# Altium project OCP-TimeCardMini-TI.PrjPcb (part 2 of 6)

## Sheet 07-1G Phy1.SchDoc
size B; SheetNumber: 7; SheetTotal: 25; SPICEModelCacheWFXGVWAF: <root> / <DocumentId>WFXGVWAF</DocumentId> / <CacheFrame Number="0"> / <Model Name="emk105bj105_v-f" Kind="CKT"> / <Text>* EMK105BJ105_V-F     SPICE MODEL  ( General Type ) / *-------------------------------------------------------------------------------------------------------- / * Model Generated by TAIYO YUDEN Corporation (http://www.ty-top.com) / * Version 1.0 / * TAIYO YUDEN Control No. 170508_130520 / * Copyright(c) 2012 TAIYO YUDEN CO.,LTD. All Rights Reserved. / *-------------------------------------------------------------------------------------------------------- / * / * Products Name : Multilayer Ceramic Capacitors / * / * Characteristics : / *     Capacitance : 1 uF , Rated Voltage : 16V , TCC : X5R / *     Case Size : 1.0 x 0.5 / 0.039 x 0.02 [mm/inch] , Thickness : 0.5 / 0.02 [mm/inch] / *     (Conditions: Temperature = 25 degC , DC Bias Current/Voltage = 0A / 0V) / * / * Frequency Range : 40Hz - 3GHz / * / * External Node Assignments : / * / *  1  o---| |---o  2 / * / *-------------------------------------------------------------------------------------------------------- / .SubCkt EMK105BJ105_V-F 1 2 / **************************** / C0 1 110 0.68309u / Cm 1 101 0.26053u / C1 101 102 0.94076u / Rc1 101 102 1.9029k / C2 102 103 0.66707u / Rc2 102 103 120.36 / C3 103 110 0.57203u / Rc3 103 110 2.1097 / C2m 1 301 0.1871u / C21 301 302 3.2494u / Rc21 301 302 1.1117k / C22 302 303 2.1014u / Rc22 302 303 1.484k / C23 303 304 2.1172u / Rc23 303 304 1.3876k / C24 304 305 0.75729u / Rc24 304 305 332.59 / C25 305 306 0.94401u / Rc25 305 306 249.09 / C26 306 307 0.34674u / Rc26 306 307 28.352 / C27 307 308 0.37158u / Rc27 307 308 19.989 / C28 308 309 0.17933u / Rc28 308 309 31.748 / C29 309 110 0.016445u / Rc29 309 110 1.0592 / Rp0 1 110 100Meg / L0 110 120 0.2216n / Lm 120 130 0.1509n / L1 120 121 0.12659n / RL1 121 130 0.85161 / L2 120 122 0.15996n / RL2 122 130 0.42469 / L3 120 123 7.9543n / RL3 123 130 0.54643m / CR 120 124 0.24334u / LR 124 125 0.090738n / RR 125 130 68.076m / CL 130 140 2.7354p / LL 130 140 0.10762n / RL 130 140 50.614 / Rs 140 2 7.5416m / **************************** / .ends EMK105BJ105_V-F</Text> / </Model> / </CacheFrame> / </root>
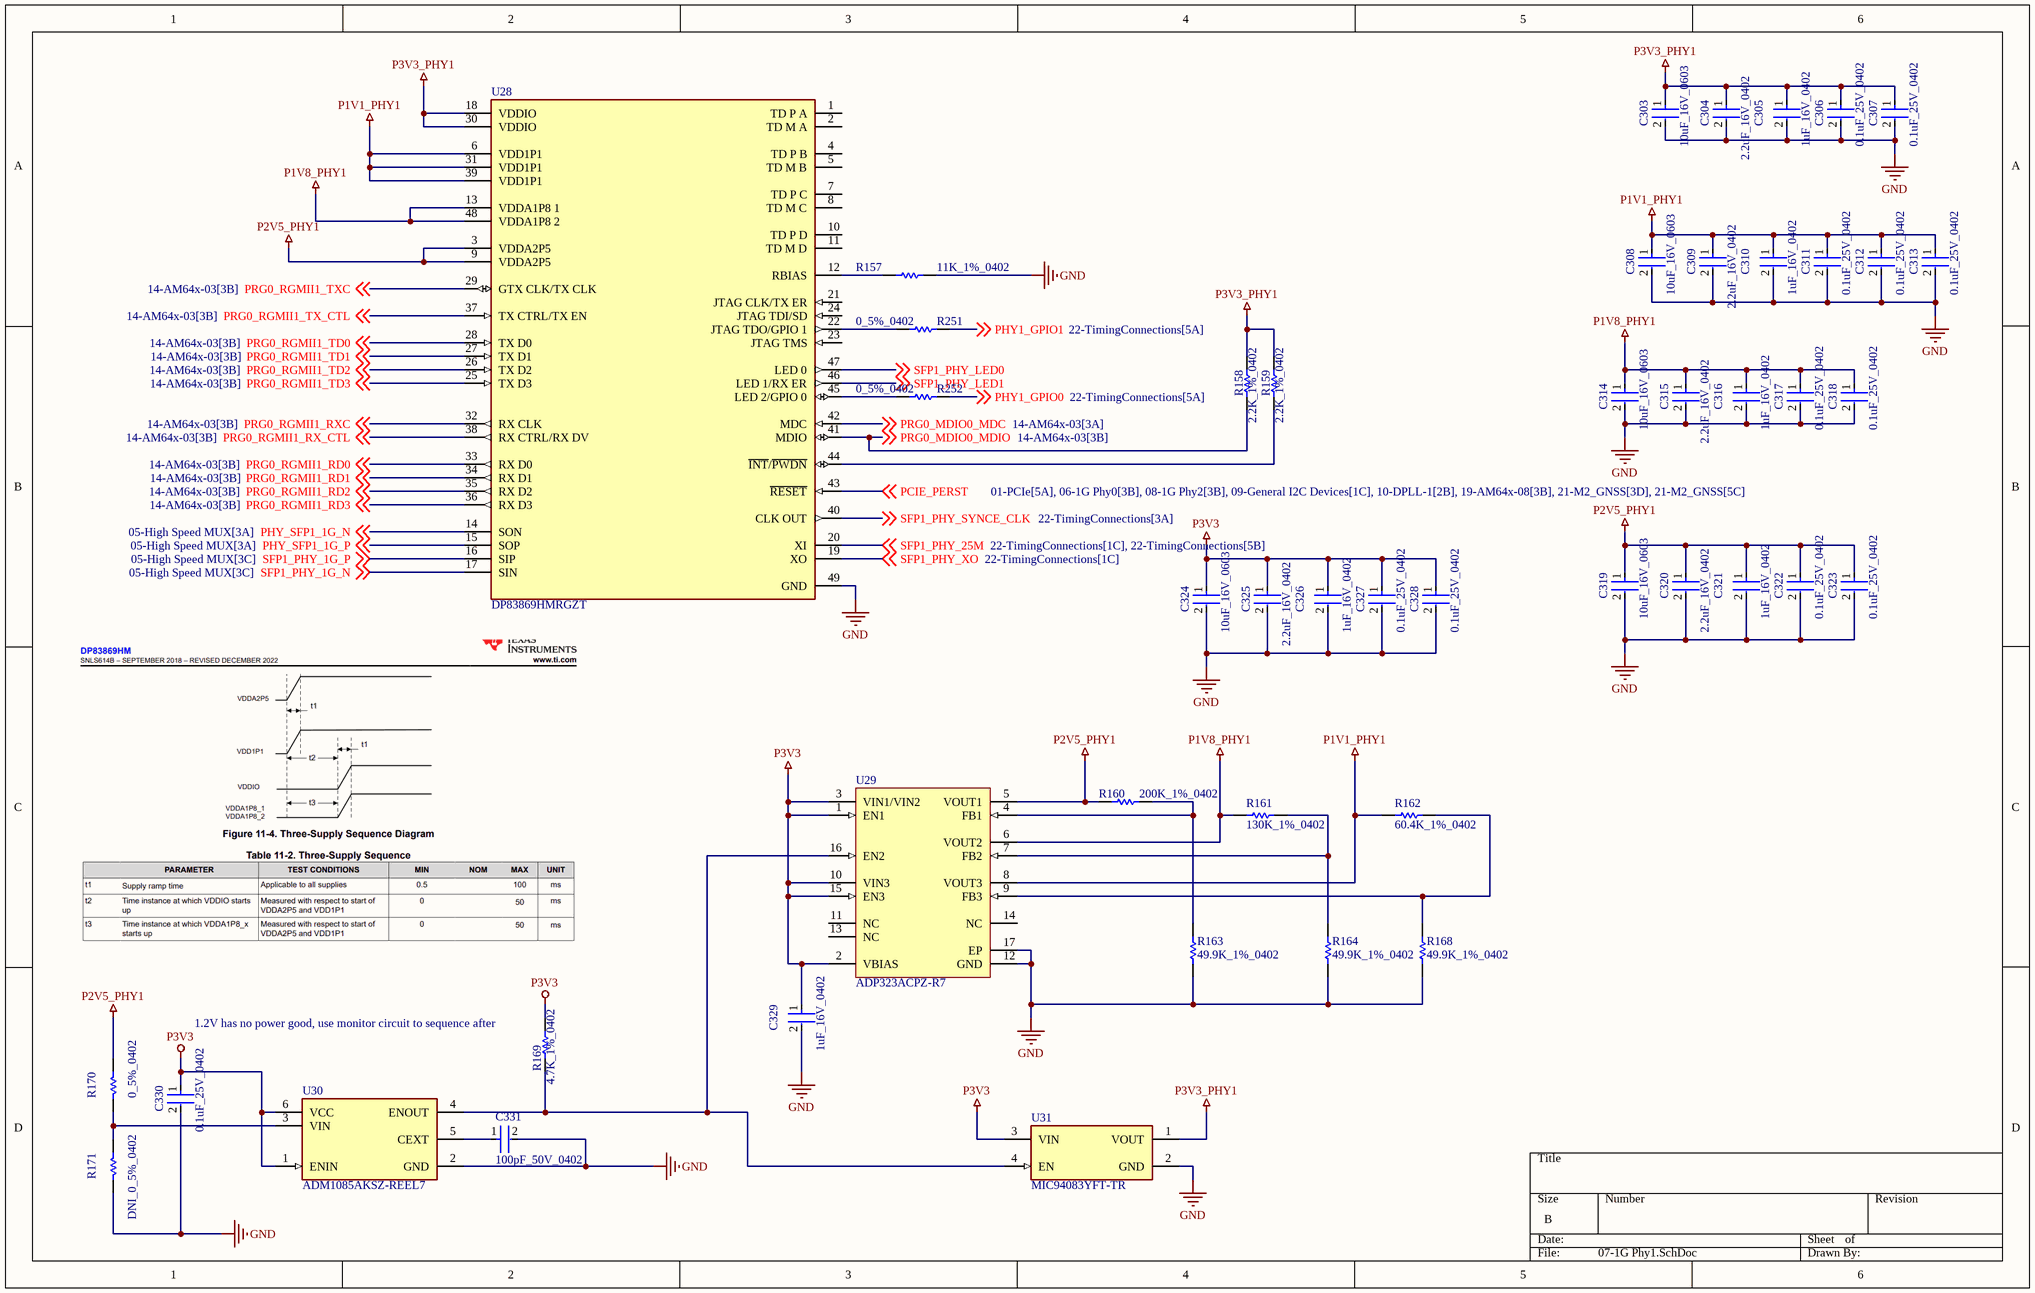
[diagram p6: 07-1G Phy1.SchDoc]

### Parts
C303  10uF_16V_0603  [FP-0603-L_1_6_0_2-W_0_8_0-MFG]
C304  2.2uF_16V_0402  [FP-C1005-050-0_05-IPC_A]
C305  1uF_16V_0402  [FP-0402-L_1_0_0_05-W_0_5-IPC_A]
C306  0.1uF_25V_0402  [FP-0402-L_1_0_1-W_0_5_0_1-IPC_C]
C307  0.1uF_25V_0402  [FP-0402-L_1_0_1-W_0_5_0_1-IPC_C]
C308  10uF_16V_0603  [FP-0603-L_1_6_0_2-W_0_8_0-MFG]
C309  2.2uF_16V_0402  [FP-C1005-050-0_05-IPC_A]
C310  1uF_16V_0402  [FP-0402-L_1_0_0_05-W_0_5-IPC_A]
C311  0.1uF_25V_0402  [FP-0402-L_1_0_1-W_0_5_0_1-IPC_C]
C312  0.1uF_25V_0402  [FP-0402-L_1_0_1-W_0_5_0_1-IPC_C]
C313  0.1uF_25V_0402  [FP-0402-L_1_0_1-W_0_5_0_1-IPC_C]
C314  10uF_16V_0603  [FP-0603-L_1_6_0_2-W_0_8_0-MFG]
C315  2.2uF_16V_0402  [FP-C1005-050-0_05-IPC_A]
C316  1uF_16V_0402  [FP-0402-L_1_0_0_05-W_0_5-IPC_A]
C317  0.1uF_25V_0402  [FP-0402-L_1_0_1-W_0_5_0_1-IPC_C]
C318  0.1uF_25V_0402  [FP-0402-L_1_0_1-W_0_5_0_1-IPC_C]
C319  10uF_16V_0603  [FP-0603-L_1_6_0_2-W_0_8_0-MFG]
C320  2.2uF_16V_0402  [FP-C1005-050-0_05-IPC_A]
C321  1uF_16V_0402  [FP-0402-L_1_0_0_05-W_0_5-IPC_A]
C322  0.1uF_25V_0402  [FP-0402-L_1_0_1-W_0_5_0_1-IPC_C]
C323  0.1uF_25V_0402  [FP-0402-L_1_0_1-W_0_5_0_1-IPC_C]
C324  10uF_16V_0603  [FP-0603-L_1_6_0_2-W_0_8_0-MFG]
C325  2.2uF_16V_0402  [FP-C1005-050-0_05-IPC_A]
C326  1uF_16V_0402  [FP-0402-L_1_0_0_05-W_0_5-IPC_A]
C327  0.1uF_25V_0402  [FP-0402-L_1_0_1-W_0_5_0_1-IPC_C]
C328  0.1uF_25V_0402  [FP-0402-L_1_0_1-W_0_5_0_1-IPC_C]
C329  1uF_16V_0402  [FP-0402-L_1_0_0_05-W_0_5-IPC_A]
C330  0.1uF_25V_0402  [FP-0402-L_1_0_1-W_0_5_0_1-IPC_C]
C331  100pF_50V_0402  [FP-C0402-BB-MFG]
R157  11K_1%_0402  [RESC1005X40X25LL05T10]
R158  2.2K_1%_0402  [RESC1005X40X25ML10T10]
R159  2.2K_1%_0402  [RESC1005X40X25ML10T10]
R160  200K_1%_0402  [RESC1005X40X25LL10T10]
R161  130K_1%_0402  [RESC1005X40X25NL10T10]
R162  60.4K_1%_0402  [RESC1005X40X25LL05T10]
R163  49.9K_1%_0402  [RESC1005X40X25LL10T10]
R164  49.9K_1%_0402  [RESC1005X40X25LL10T10]
R168  49.9K_1%_0402  [RESC1005X40X25LL10T10]
R169  4.7K_1%_0402  [RESC1005X40X25NL10T10]
R170  0_5%_0402  [RESC1005X40X25LL10T10]
R171  DNI_0_5%_0402  [RESC1005X40X25LL10T10]  (no BOM)
R251  0_5%_0402  [RESC1005X40X25LL10T10]
R252  0_5%_0402  [RESC1005X40X25LL10T10]
U28  DP83869HMRGZT  [FP-RGZ0048B-IPC_A]
U29  ADP323ACPZ-R7  [ADI-CP-16-27_N]
U30  ADM1085AKSZ-REEL7  [FP-KS-6-IPC_B]
U31  MIC94083YFT-TR  [FP-FTDFN085085-4LD-PL-1-MFG]

### Nets
GND: C303.2 C304.2 C305.2 C306.2 C307.2 C308.2 C309.2 C310.2 C311.2 C312.2 C313.2 C314.2 C315.2 C316.2 C317.2 C318.2 C319.2 C320.2 C321.2 C322.2 C323.2 C324.2 C325.2 C326.2 C327.2 C328.2 C329.2 C330.2 C331.2 R157.2 R163.1 R164.1 R168.1 R171.2 U28.49(GND) U29.12(GND) U29.17(EP) U30.2(GND) U31.2(GND)
P1V1_PHY1: C308.1 C309.1 C310.1 C311.1 C312.1 C313.1 R162.1 U28.6(VDD1P1) U28.31(VDD1P1) U28.39(VDD1P1) U29.8(VOUT3)
P1V8_PHY1: C314.1 C315.1 C316.1 C317.1 C318.1 R161.1 U28.13(VDDA1P8_1) U28.48(VDDA1P8_2) U29.6(VOUT2)
P2V5_PHY1: C319.1 C320.1 C321.1 C322.1 C323.1 R160.1 R170.1 U28.3(VDDA2P5) U28.9(VDDA2P5) U29.5(VOUT1)
P3V3: C324.1 C325.1 C326.1 C327.1 C328.1 C329.1 C330.1 R169.1 U29.1(EN1) U29.2(VBIAS) U29.3(VIN1/VIN2) U29.10(VIN3) U29.15(EN3) U30.1(ENIN) U30.6(VCC) U31.3(VIN)
P3V3_PHY1: C303.1 C304.1 C305.1 C306.1 C307.1 R158.2 R159.2 U28.18(VDDIO) U28.30(VDDIO) U31.1(VOUT)
PCIE_PERST: U28.43(~{RESET}) ; off-sheet PCIE_PERST
PHY1_GPIO0: R252.2 ; off-sheet PHY1_GPIO0
PHY1_GPIO1: R251.2 ; off-sheet PHY1_GPIO1
PHY_SFP1_1G_N: U28.14(SON) ; off-sheet PHY_SFP1_1G_N
PHY_SFP1_1G_P: U28.15(SOP) ; off-sheet PHY_SFP1_1G_P
PRG0_MDIO0_MDC: U28.42(MDC) ; off-sheet PRG0_MDIO0_MDC
PRG0_MDIO0_MDIO: R158.1 U28.41(MDIO) ; off-sheet PRG0_MDIO0_MDIO
PRG0_RGMII1_RD0: U28.33(RX_D0) ; off-sheet PRG0_RGMII1_RD0
PRG0_RGMII1_RD1: U28.34(RX_D1) ; off-sheet PRG0_RGMII1_RD1
PRG0_RGMII1_RD2: U28.35(RX_D2) ; off-sheet PRG0_RGMII1_RD2
PRG0_RGMII1_RD3: U28.36(RX_D3) ; off-sheet PRG0_RGMII1_RD3
PRG0_RGMII1_RX_CTL: U28.38(RX_CTRL/RX_DV) ; off-sheet PRG0_RGMII1_RX_CTL
PRG0_RGMII1_RXC: U28.32(RX_CLK) ; off-sheet PRG0_RGMII1_RXC
PRG0_RGMII1_TD0: U28.28(TX_D0) ; off-sheet PRG0_RGMII1_TD0
PRG0_RGMII1_TD1: U28.27(TX_D1) ; off-sheet PRG0_RGMII1_TD1
PRG0_RGMII1_TD2: U28.26(TX_D2) ; off-sheet PRG0_RGMII1_TD2
PRG0_RGMII1_TD3: U28.25(TX_D3) ; off-sheet PRG0_RGMII1_TD3
PRG0_RGMII1_TX_CTL: U28.37(TX_CTRL/TX_EN) ; off-sheet PRG0_RGMII1_TX_CTL
PRG0_RGMII1_TXC: U28.29(GTX_CLK/TX_CLK) ; off-sheet PRG0_RGMII1_TXC
SFP1_PHY_1G_N: U28.17(SIN) ; off-sheet SFP1_PHY_1G_N
SFP1_PHY_1G_P: U28.16(SIP) ; off-sheet SFP1_PHY_1G_P
SFP1_PHY_25M: U28.20(XI) ; off-sheet SFP1_PHY_25M
SFP1_PHY_LED0: U28.47(LED_0) ; off-sheet SFP1_PHY_LED0
SFP1_PHY_LED1: U28.46(LED_1/RX_ER) ; off-sheet SFP1_PHY_LED1
SFP1_PHY_SYNCE_CLK: U28.40(CLK_OUT) ; off-sheet SFP1_PHY_SYNCE_CLK
SFP1_PHY_XO: U28.19(XO) ; off-sheet SFP1_PHY_XO
NetC331_1: C331.1 U30.5(CEXT)
NetR157_1: R157.1 U28.12(RBIAS)
NetR159_1: R159.1 U28.44(~{INT}/~{PWDN})
NetR160_2: R160.2 R163.2 U29.4(FB1)
NetR161_2: R161.2 R164.2 U29.7(FB2)
NetR162_2: R162.2 R168.2 U29.9(FB3)
NetR169_2: R169.2 U29.16(EN2) U30.4(ENOUT) U31.4(EN)
NetR170_2: R170.2 R171.1 U30.3(VIN)
NetR251_1: R251.1 U28.22(JTAG_TDO/GPIO_1)
NetR252_1: R252.1 U28.45(LED_2/GPIO_0)

Not connected (* = marked no-connect by the designer): U28 1(TD_P_A) 2(TD_M_A) 4(TD_P_B) 5(TD_M_B) 7(TD_P_C) 8(TD_M_C) 10(TD_P_D) 11(TD_M_D) 21(JTAG_CLK/TX_ER) 23(JTAG_TMS) 24(JTAG_TDI/SD); U29 11(NC) 13(NC) 14(NC)

### Notes on the sheet
- (near R169) 1.2V has no power good, use monitor circuit to sequence after

### Library data of the parts
C303 C308 C314 C319 C324 = CMP-2000-06226-4: Multilayer Ceramic Capacitor 10uF 16V X5R 20% SMD 0603 T/R; Packaging: Tape and Reel; Construction: Flat; Height: 0.8mm; Max Operating Temperature: 85°C; Dielectric: X5R; Case Code (Metric): 1608; Voltage Rating (DC): 16V; Width: 0.031inch; Voltage Rating: 16V; Length: 0.063inch; RoHS Compliant: Yes; Halogen Free: Halogen Free; Case Code (Imperial): 0603; Capacitance: 10uF; Mount: Surface Mount; Thickness: 0.031inch; Tolerance: 20%; Min Operating Temperature: -55°C; Series: M; Termination: SMD/SMT; Case/Package: 0603; Package Quantity: 1
C304 C309 C315 C320 C325 = CMP-2000-05998-2: Multilayer Ceramic Capacitors 2.2μF ±10% 16V X5R SMD 0402; Capacitance: 2.2uF; REACH SVHC: No SVHC; Series: C; Termination: SMD/SMT; Case Code (Imperial): 0402; Depth: 0.5mm; Mount: Surface Mount; Width: 0.02inch; Package Quantity: 1; Dielectric Material: Ceramic; Length: 1mm; Packaging: Tape and Reel; Case Code (Metric): 1005; RoHS Compliant: Yes; Dielectric: X5R; Max Operating Temperature: 85°C; Lead Free: Lead Free; Weight: 2.3E-05oz; Thickness: 0.022inch; Voltage Rating (DC): 16V; Tolerance: 10%; Voltage Rating: 16V; Resistor Type: Ceramic; Height: 0.5mm; Case/Package: 0402; Min Operating Temperature: -55°C
C305 C310 C316 C321 C326 C329 = CMP-14477-000104-2: None; Tolerance: 10%; Voltage Rating: 16V; Dielectric: X5R; Capacitance: 1uF; Packaging: Tape and Reel; Depth: 0.5mm; Mount: Surface Mount; Thickness: 0.022inch; Package Quantity: 1; Min Operating Temperature: -55°C; Series: M; Voltage Rating (DC): 16V; Termination: SMD/SMT; Case/Package: 0402; Number of Pins: 2; Case Code (Imperial): 0402; Length: 1mm; Halogen Free: Halogen Free; Case Code (Metric): 1005; Width: 0.02inch; RoHS Compliant: Yes; Radiation Hardening: No; Max Operating Temperature: 85°C; Height: 0.5mm; Construction: Flat
C306 C307 C311-C313 C317 C318 C322 C323 C327 C328 C330 = CMP-2008-02519-2: as C26 on sheet 02-USER_IO; Package Quantity: 1; Capacitance: 100nF; Min Operating Temperature: -55°C; Voltage: 25V; Voltage Rating: 25V; Construction: Flat; Max Operating Temperature: 125°C; Radiation Hardening: No; Depth: 0.5mm; Thickness: 0.022inch; Voltage Rating (DC): 25V; Number of Pins: 2; Lead Free: Lead Free; Series: -; REACH SVHC: No SVHC; Length: 1mm; Dielectric: X7R; RoHS Compliant: Yes; Mount: Surface Mount; Packaging: Tape and Reel; Case/Package: 0402; Case Code (Imperial): 0402; Termination: SMD/SMT; Width: 0.02inch; Case Code (Metric): 1005; Tolerance: 10%
C331 = CMP-2008-03417-2: CAP CER 100PF 50V C0G/NP0 0402; Manufacturer: Kemet; Manufacturer Part Number: C0402C101G5GACTU; Material: Ceramic; Temperature Characteristic: C0G; Tolerance: 0.02; Temperature Coefficient: 15%; Temperature Range High: +125°C; Lead Free: Yes; Capacitance: 100 pF; Value: 100 pF; ComponentLink2URL: https://content.kemet.com/datasheets/KEM_C1002_X7R_SMD.pdf; Automotive: No; Voltage Rating: 50 V; Category: Cap; Device Class L2: Capacitors; ComponentLink2Description: Datasheet; Mouser Description: Multilayer Ceramic Capacitors MLCC - SMD/SMT 50volts 100pF C0G 2%; RoHS: TRUE; Device Class L3: Ceramic Capacitors; Temperature Range Low: -55°C; Octopart: https://octopart.com/c0402c101g5gactu-kemet-16782744; Height: 0.55mm; Ipc Land Pattern Name: CAPC10050X50; Package: C0402-BB; Device Class L1: Passive Components; Temperature: -55°C to +125°C; Digikey Description: CAP CER 100PF 50V C0G/NP0 0402
R157 = CMP-2002-07365-1: Manufacturer: Yageo / Phycomp; Part Number: RC0402FR-0711KL
R158 R159 = CMP-2002-06097-1: Part Number: MC00625W040212K2; Manufacturer: Multicomp
R160 = CMP-2002-04904-1: Part Number: CR0402-FX-2003GLF; Manufacturer: Bourns
R161 = CMP-2002-05688-1: Part Number: CRG0402F130K; Manufacturer: TE Connectivity / AMP
R162 = CMP-2002-07763-1: Manufacturer: Yageo / Phycomp; Part Number: RC0402FR-0760K4L
R163 R164 R168 = CMP-1011-00702-2: Manufacturer: Bourns; Part Number: CR0402-FX-4992GLF
R169 = CMP-2002-05217-1: as R22 on sheet 01-PCIe
R170 R171 R251 R252 = CMP-2002-04569-1: as R23 on sheet 01-PCIe
U28 = CMP-04874-000002-2: IC TRANSCEIVER 1/1 48FN; RoHS Compliant: Yes
U29 = CMP-0786-00062-1: Triple, 200 mA, Low Noise, High PSRR Voltage Regulator, 2.5 to 5.5 V Vin, Adjustable Vout, Industrial, 16-pin QFN (CP-16-27), Reel; Manufacturer: Analog Devices; Vout Adjustable Range: 0.5V to 5V; Iout max: 200mA; Vin (max) (V): 5.5; Supply Current IGND @ Small Load: 85uA; Vin (min) (V): 2.5; ComponentLink2URL: http://www.analog.com/static/imported-files/data_sheets/ADP322_323.pdf; Code_JEDEC: MO-229; Mounting Technology: Surface Mount; DatasheetVersion: Rev. A; PartNumber: ADP323ACPZ-R7; ComponentLink3URL: http://www.analog.com/static/imported-files/packages/PKG_PDF/LFCSP(CP)/CP_16_27.pdf; ComponentLink4Description: URL Link1; PackageVersion: 091609-A, 09/2009; ComponentLink1Description: Manufacturer URL; ComponentLink3Description: Package Specification; Packing: Reel; PackageReference: CP-16-27; ComponentLink4URL: Product URL:http://www.analog.com/en/ADP323/productSearch.html; ComponentLink1URL: http://www.analog.com/en/index.html; PackageDescription: 16-Pin Lead Frame Chip Scale Package, Body 3 x 3 mm, Pitch 0.5 mm; ComponentLink2Description: Datasheet
U30 = CMP-09140-000008-1: IC SUPERVISOR 1 CHANNEL SC70-6; Min Reset Threshold Voltage: 560mV; Operating Supply Voltage: 125V; Operating Supply Current: 10uA; Reset: Active High; Max Reset Threshold Voltage: 640mV; Watchdog Timer: No; Min Supply Voltage: 2.25V; Number of Voltages Monitored: 1; Max Supply Current: 15uA; Threshold Voltage: 600mV; Max Supply Voltage: 3.6V; Nominal Supply Current: 10uA; Mount: Surface Mount; Width: 1.35mm; Max Operating Temperature: 125°C; Lead Free: Contains Lead; Package Quantity: 3000; Undervoltage Threshold: 560mV; Type: Sequencer; Packaging: Tape and Reel; Min Operating Temperature: -40°C; Radiation Hardening: No; REACH SVHC: No SVHC; Overvoltage Threshold: 640mV; Number of Pins: 6; Case/Package: SC; Length: 2.2mm; Height: 1mm; Number of Monitored Inputs: 1
U31 = CMP-06317-000053-1: IC PWR SWITCH P-CHAN 1:1 4TMLF; Turn-On Delay Time: 1.5us; Turn-Off Delay Time: 200ns; On-State Resistance: 67mR; Output Current: 2A; Min Supply Voltage: 1.7V; Number of Outputs: 1; Interface: On/Off; Output Configuration: High Side; Max Supply Voltage: 5.5V; Radiation Hardening: No; Min Operating Temperature: -40°C; Mount: Surface Mount; Series: -; RoHS Compliant: Yes; Number of Pins: 4; Reach SVHC Compliant: Yes; On-state Resistance-Max: 67MR; Package Quantity: 5000; Packaging: Tape and Reel; Max Output Current: 2A; Supply Current: 2A; Lead Free: Lead Free; Current Rating: 2A; Max Operating Temperature: 125°C; Rated Current-Max: 2A; Nominal Supply Current: 2A

## Sheet 08-1G Phy2.SchDoc
size B; SheetNumber: 8; SheetTotal: 25; SPICEModelCacheUFVORJTV: <root> / <DocumentId>UFVORJTV</DocumentId> / <CacheFrame Number="0"> / <Model Name="emk105bj105_v-f" Kind="CKT"> / <Text>* EMK105BJ105_V-F     SPICE MODEL  ( General Type ) / *-------------------------------------------------------------------------------------------------------- / * Model Generated by TAIYO YUDEN Corporation (http://www.ty-top.com) / * Version 1.0 / * TAIYO YUDEN Control No. 170508_130520 / * Copyright(c) 2012 TAIYO YUDEN CO.,LTD. All Rights Reserved. / *-------------------------------------------------------------------------------------------------------- / * / * Products Name : Multilayer Ceramic Capacitors / * / * Characteristics : / *     Capacitance : 1 uF , Rated Voltage : 16V , TCC : X5R / *     Case Size : 1.0 x 0.5 / 0.039 x 0.02 [mm/inch] , Thickness : 0.5 / 0.02 [mm/inch] / *     (Conditions: Temperature = 25 degC , DC Bias Current/Voltage = 0A / 0V) / * / * Frequency Range : 40Hz - 3GHz / * / * External Node Assignments : / * / *  1  o---| |---o  2 / * / *-------------------------------------------------------------------------------------------------------- / .SubCkt EMK105BJ105_V-F 1 2 / **************************** / C0 1 110 0.68309u / Cm 1 101 0.26053u / C1 101 102 0.94076u / Rc1 101 102 1.9029k / C2 102 103 0.66707u / Rc2 102 103 120.36 / C3 103 110 0.57203u / Rc3 103 110 2.1097 / C2m 1 301 0.1871u / C21 301 302 3.2494u / Rc21 301 302 1.1117k / C22 302 303 2.1014u / Rc22 302 303 1.484k / C23 303 304 2.1172u / Rc23 303 304 1.3876k / C24 304 305 0.75729u / Rc24 304 305 332.59 / C25 305 306 0.94401u / Rc25 305 306 249.09 / C26 306 307 0.34674u / Rc26 306 307 28.352 / C27 307 308 0.37158u / Rc27 307 308 19.989 / C28 308 309 0.17933u / Rc28 308 309 31.748 / C29 309 110 0.016445u / Rc29 309 110 1.0592 / Rp0 1 110 100Meg / L0 110 120 0.2216n / Lm 120 130 0.1509n / L1 120 121 0.12659n / RL1 121 130 0.85161 / L2 120 122 0.15996n / RL2 122 130 0.42469 / L3 120 123 7.9543n / RL3 123 130 0.54643m / CR 120 124 0.24334u / LR 124 125 0.090738n / RR 125 130 68.076m / CL 130 140 2.7354p / LL 130 140 0.10762n / RL 130 140 50.614 / Rs 140 2 7.5416m / **************************** / .ends EMK105BJ105_V-F</Text> / </Model> / </CacheFrame> / </root>
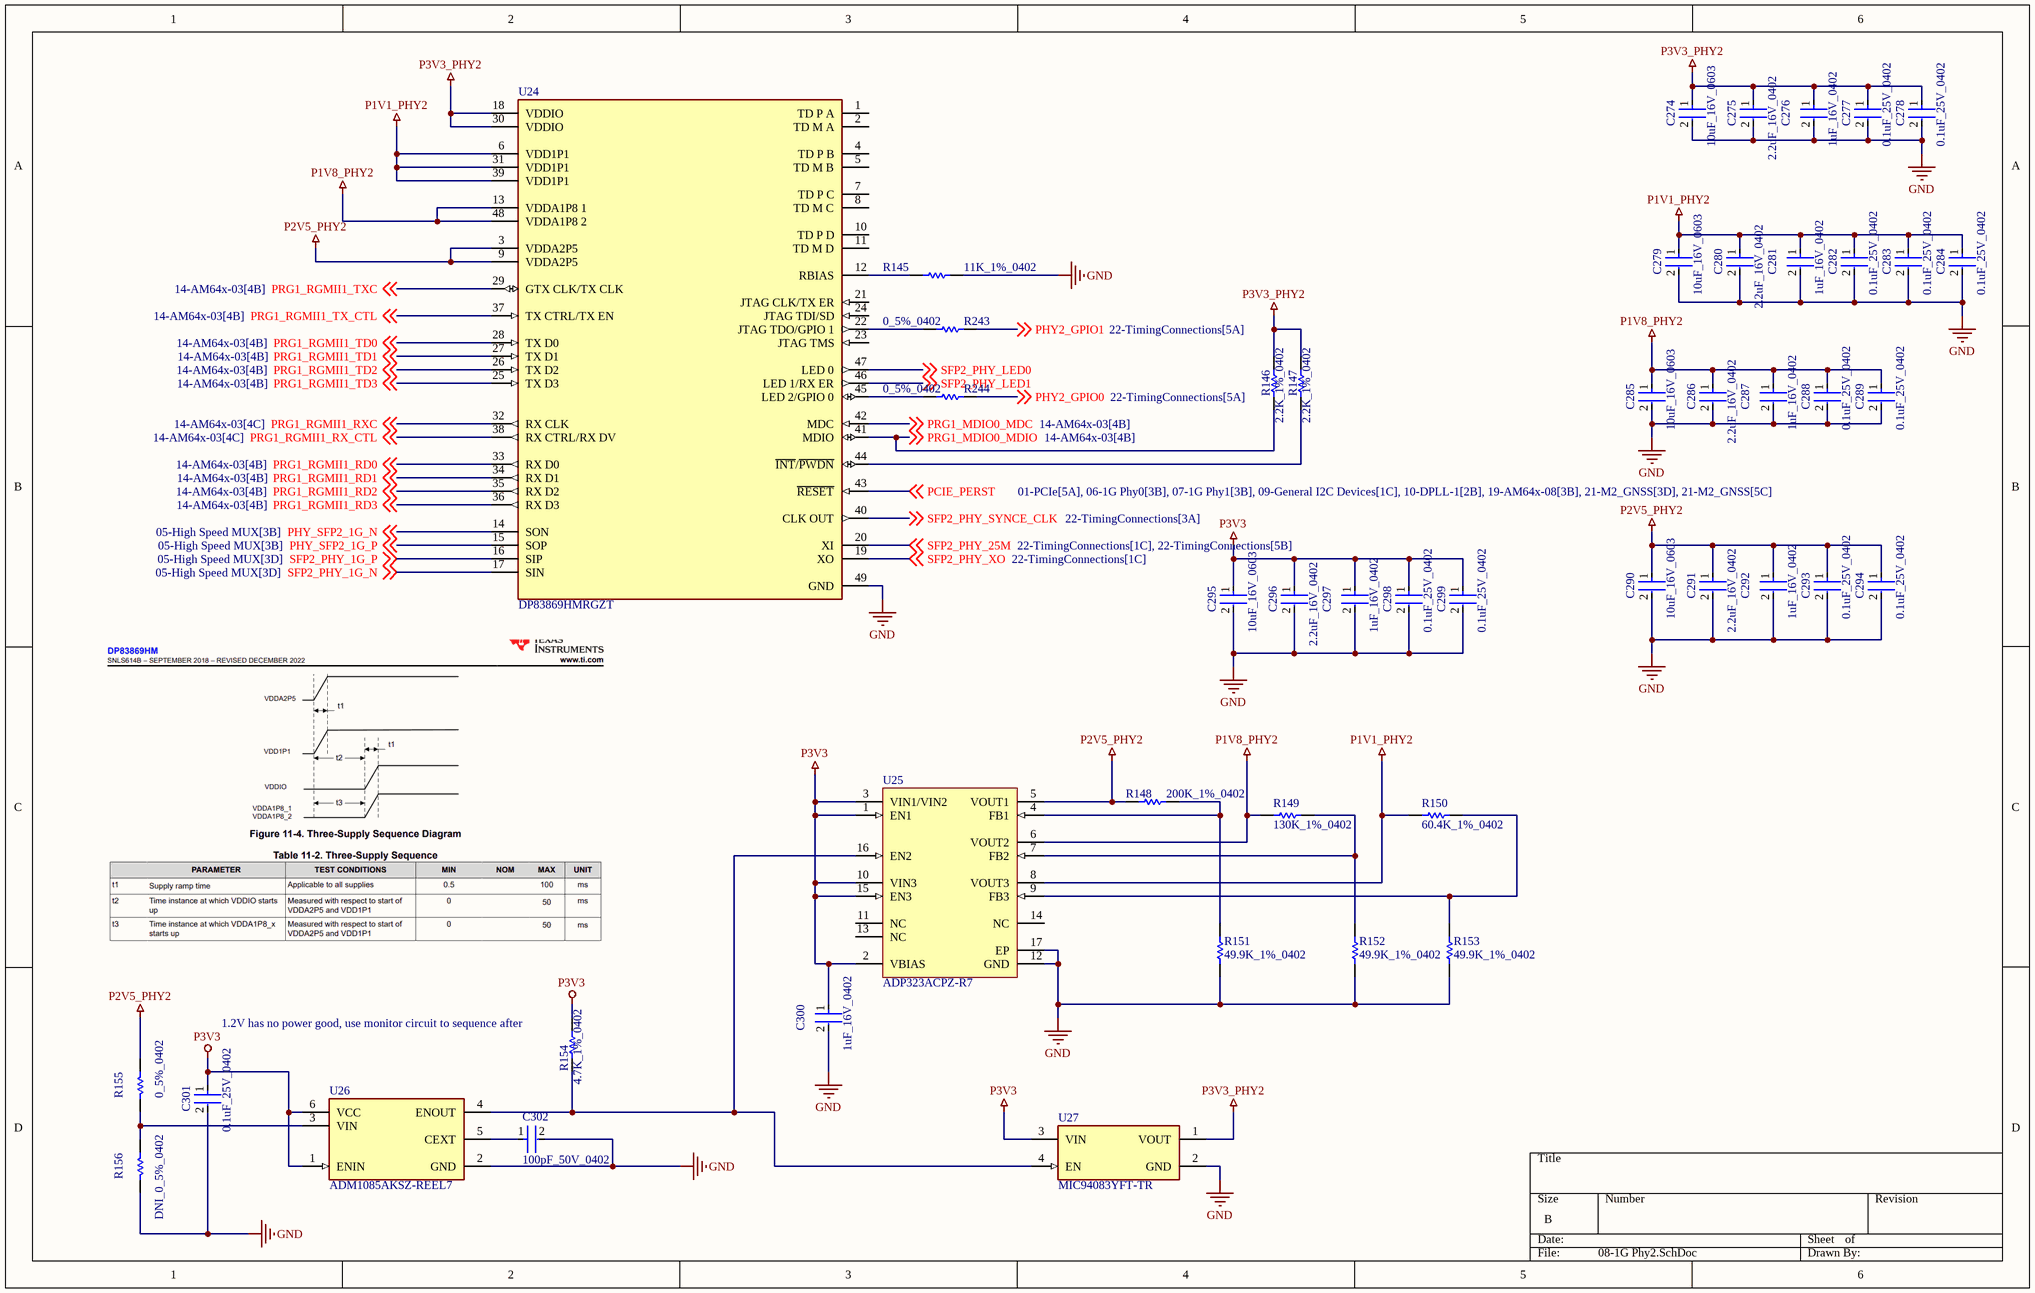
[diagram p7: 08-1G Phy2.SchDoc]

### Parts
C274  10uF_16V_0603  [FP-0603-L_1_6_0_2-W_0_8_0-MFG]
C275  2.2uF_16V_0402  [FP-C1005-050-0_05-IPC_A]
C276  1uF_16V_0402  [FP-0402-L_1_0_0_05-W_0_5-IPC_A]
C277  0.1uF_25V_0402  [FP-0402-L_1_0_1-W_0_5_0_1-IPC_C]
C278  0.1uF_25V_0402  [FP-0402-L_1_0_1-W_0_5_0_1-IPC_C]
C279  10uF_16V_0603  [FP-0603-L_1_6_0_2-W_0_8_0-MFG]
C280  2.2uF_16V_0402  [FP-C1005-050-0_05-IPC_A]
C281  1uF_16V_0402  [FP-0402-L_1_0_0_05-W_0_5-IPC_A]
C282  0.1uF_25V_0402  [FP-0402-L_1_0_1-W_0_5_0_1-IPC_C]
C283  0.1uF_25V_0402  [FP-0402-L_1_0_1-W_0_5_0_1-IPC_C]
C284  0.1uF_25V_0402  [FP-0402-L_1_0_1-W_0_5_0_1-IPC_C]
C285  10uF_16V_0603  [FP-0603-L_1_6_0_2-W_0_8_0-MFG]
C286  2.2uF_16V_0402  [FP-C1005-050-0_05-IPC_A]
C287  1uF_16V_0402  [FP-0402-L_1_0_0_05-W_0_5-IPC_A]
C288  0.1uF_25V_0402  [FP-0402-L_1_0_1-W_0_5_0_1-IPC_C]
C289  0.1uF_25V_0402  [FP-0402-L_1_0_1-W_0_5_0_1-IPC_C]
C290  10uF_16V_0603  [FP-0603-L_1_6_0_2-W_0_8_0-MFG]
C291  2.2uF_16V_0402  [FP-C1005-050-0_05-IPC_A]
C292  1uF_16V_0402  [FP-0402-L_1_0_0_05-W_0_5-IPC_A]
C293  0.1uF_25V_0402  [FP-0402-L_1_0_1-W_0_5_0_1-IPC_C]
C294  0.1uF_25V_0402  [FP-0402-L_1_0_1-W_0_5_0_1-IPC_C]
C295  10uF_16V_0603  [FP-0603-L_1_6_0_2-W_0_8_0-MFG]
C296  2.2uF_16V_0402  [FP-C1005-050-0_05-IPC_A]
C297  1uF_16V_0402  [FP-0402-L_1_0_0_05-W_0_5-IPC_A]
C298  0.1uF_25V_0402  [FP-0402-L_1_0_1-W_0_5_0_1-IPC_C]
C299  0.1uF_25V_0402  [FP-0402-L_1_0_1-W_0_5_0_1-IPC_C]
C300  1uF_16V_0402  [FP-0402-L_1_0_0_05-W_0_5-IPC_A]
C301  0.1uF_25V_0402  [FP-0402-L_1_0_1-W_0_5_0_1-IPC_C]
C302  100pF_50V_0402  [FP-C0402-BB-MFG]
R145  11K_1%_0402  [RESC1005X40X25LL05T10]
R146  2.2K_1%_0402  [RESC1005X40X25ML10T10]
R147  2.2K_1%_0402  [RESC1005X40X25ML10T10]
R148  200K_1%_0402  [RESC1005X40X25LL10T10]
R149  130K_1%_0402  [RESC1005X40X25NL10T10]
R150  60.4K_1%_0402  [RESC1005X40X25LL05T10]
R151  49.9K_1%_0402  [RESC1005X40X25LL10T10]
R152  49.9K_1%_0402  [RESC1005X40X25LL10T10]
R153  49.9K_1%_0402  [RESC1005X40X25LL10T10]
R154  4.7K_1%_0402  [RESC1005X40X25NL10T10]
R155  0_5%_0402  [RESC1005X40X25LL10T10]
R156  DNI_0_5%_0402  [RESC1005X40X25LL10T10]  (no BOM)
R243  0_5%_0402  [RESC1005X40X25LL10T10]
R244  0_5%_0402  [RESC1005X40X25LL10T10]
U24  DP83869HMRGZT  [FP-RGZ0048B-IPC_A]
U25  ADP323ACPZ-R7  [ADI-CP-16-27_N]
U26  ADM1085AKSZ-REEL7  [FP-KS-6-IPC_B]
U27  MIC94083YFT-TR  [FP-FTDFN085085-4LD-PL-1-MFG]

### Nets
GND: C274.2 C275.2 C276.2 C277.2 C278.2 C279.2 C280.2 C281.2 C282.2 C283.2 C284.2 C285.2 C286.2 C287.2 C288.2 C289.2 C290.2 C291.2 C292.2 C293.2 C294.2 C295.2 C296.2 C297.2 C298.2 C299.2 C300.2 C301.2 C302.2 R145.2 R151.1 R152.1 R153.1 R156.2 U24.49(GND) U25.12(GND) U25.17(EP) U26.2(GND) U27.2(GND)
P1V1_PHY2: C279.1 C280.1 C281.1 C282.1 C283.1 C284.1 R150.1 U24.6(VDD1P1) U24.31(VDD1P1) U24.39(VDD1P1) U25.8(VOUT3)
P1V8_PHY2: C285.1 C286.1 C287.1 C288.1 C289.1 R149.1 U24.13(VDDA1P8_1) U24.48(VDDA1P8_2) U25.6(VOUT2)
P2V5_PHY2: C290.1 C291.1 C292.1 C293.1 C294.1 R148.1 R155.1 U24.3(VDDA2P5) U24.9(VDDA2P5) U25.5(VOUT1)
P3V3: C295.1 C296.1 C297.1 C298.1 C299.1 C300.1 C301.1 R154.1 U25.1(EN1) U25.2(VBIAS) U25.3(VIN1/VIN2) U25.10(VIN3) U25.15(EN3) U26.1(ENIN) U26.6(VCC) U27.3(VIN)
P3V3_PHY2: C274.1 C275.1 C276.1 C277.1 C278.1 R146.2 R147.2 U24.18(VDDIO) U24.30(VDDIO) U27.1(VOUT)
PCIE_PERST: U24.43(~{RESET}) ; off-sheet PCIE_PERST
PHY2_GPIO0: R244.2 ; off-sheet PHY2_GPIO0
PHY2_GPIO1: R243.2 ; off-sheet PHY2_GPIO1
PHY_SFP2_1G_N: U24.14(SON) ; off-sheet PHY_SFP2_1G_N
PHY_SFP2_1G_P: U24.15(SOP) ; off-sheet PHY_SFP2_1G_P
PRG1_MDIO0_MDC: U24.42(MDC) ; off-sheet PRG1_MDIO0_MDC
PRG1_MDIO0_MDIO: R146.1 U24.41(MDIO) ; off-sheet PRG1_MDIO0_MDIO
PRG1_RGMII1_RD0: U24.33(RX_D0) ; off-sheet PRG1_RGMII1_RD0
PRG1_RGMII1_RD1: U24.34(RX_D1) ; off-sheet PRG1_RGMII1_RD1
PRG1_RGMII1_RD2: U24.35(RX_D2) ; off-sheet PRG1_RGMII1_RD2
PRG1_RGMII1_RD3: U24.36(RX_D3) ; off-sheet PRG1_RGMII1_RD3
PRG1_RGMII1_RX_CTL: U24.38(RX_CTRL/RX_DV) ; off-sheet PRG1_RGMII1_RX_CTL
PRG1_RGMII1_RXC: U24.32(RX_CLK) ; off-sheet PRG1_RGMII1_RXC
PRG1_RGMII1_TD0: U24.28(TX_D0) ; off-sheet PRG1_RGMII1_TD0
PRG1_RGMII1_TD1: U24.27(TX_D1) ; off-sheet PRG1_RGMII1_TD1
PRG1_RGMII1_TD2: U24.26(TX_D2) ; off-sheet PRG1_RGMII1_TD2
PRG1_RGMII1_TD3: U24.25(TX_D3) ; off-sheet PRG1_RGMII1_TD3
PRG1_RGMII1_TX_CTL: U24.37(TX_CTRL/TX_EN) ; off-sheet PRG1_RGMII1_TX_CTL
PRG1_RGMII1_TXC: U24.29(GTX_CLK/TX_CLK) ; off-sheet PRG1_RGMII1_TXC
SFP2_PHY_1G_N: U24.17(SIN) ; off-sheet SFP2_PHY_1G_N
SFP2_PHY_1G_P: U24.16(SIP) ; off-sheet SFP2_PHY_1G_P
SFP2_PHY_25M: U24.20(XI) ; off-sheet SFP2_PHY_25M
SFP2_PHY_LED0: U24.47(LED_0) ; off-sheet SFP2_PHY_LED0
SFP2_PHY_LED1: U24.46(LED_1/RX_ER) ; off-sheet SFP2_PHY_LED1
SFP2_PHY_SYNCE_CLK: U24.40(CLK_OUT) ; off-sheet SFP2_PHY_SYNCE_CLK
SFP2_PHY_XO: U24.19(XO) ; off-sheet SFP2_PHY_XO
NetC302_1: C302.1 U26.5(CEXT)
NetR145_1: R145.1 U24.12(RBIAS)
NetR147_1: R147.1 U24.44(~{INT}/~{PWDN})
NetR148_2: R148.2 R151.2 U25.4(FB1)
NetR149_2: R149.2 R152.2 U25.7(FB2)
NetR150_2: R150.2 R153.2 U25.9(FB3)
NetR154_2: R154.2 U25.16(EN2) U26.4(ENOUT) U27.4(EN)
NetR155_2: R155.2 R156.1 U26.3(VIN)
NetR243_1: R243.1 U24.22(JTAG_TDO/GPIO_1)
NetR244_1: R244.1 U24.45(LED_2/GPIO_0)

Not connected (* = marked no-connect by the designer): U24 1(TD_P_A) 2(TD_M_A) 4(TD_P_B) 5(TD_M_B) 7(TD_P_C) 8(TD_M_C) 10(TD_P_D) 11(TD_M_D) 21(JTAG_CLK/TX_ER) 23(JTAG_TMS) 24(JTAG_TDI/SD); U25 11(NC) 13(NC) 14(NC)

### Notes on the sheet
- (near R154) 1.2V has no power good, use monitor circuit to sequence after

### Library data of the parts
C274 C279 C285 C290 C295 = CMP-2000-06226-4: as C303 on sheet 07-1G Phy1; Packaging: Tape and Reel; Construction: Flat; Height: 0.8mm; Max Operating Temperature: 85°C; Dielectric: X5R; Case Code (Metric): 1608; Voltage Rating (DC): 16V; Width: 0.031inch; Voltage Rating: 16V; Length: 0.063inch; RoHS Compliant: Yes; Halogen Free: Halogen Free; Case Code (Imperial): 0603; Capacitance: 10uF; Mount: Surface Mount; Thickness: 0.031inch; Tolerance: 20%; Min Operating Temperature: -55°C; Series: M; Termination: SMD/SMT; Case/Package: 0603; Package Quantity: 1
C275 C280 C286 C291 C296 = CMP-2000-05998-2: as C304 on sheet 07-1G Phy1; REACH SVHC: No SVHC; Series: C; Termination: SMD/SMT; Case Code (Imperial): 0402; Depth: 0.5mm; Mount: Surface Mount; Width: 0.02inch; Package Quantity: 1; Dielectric Material: Ceramic; Length: 1mm; Packaging: Tape and Reel; Case Code (Metric): 1005; RoHS Compliant: Yes; Dielectric: X5R; Max Operating Temperature: 85°C; Lead Free: Lead Free; Weight: 2.3E-05oz; Thickness: 0.022inch; Voltage Rating (DC): 16V; Tolerance: 10%; Voltage Rating: 16V; Resistor Type: Ceramic; Height: 0.5mm; Case/Package: 0402; Min Operating Temperature: -55°C
C276 C281 C287 C292 C297 C300 = CMP-14477-000104-2: as C305 on sheet 07-1G Phy1; Packaging: Tape and Reel; Depth: 0.5mm; Mount: Surface Mount; Thickness: 0.022inch; Package Quantity: 1; Min Operating Temperature: -55°C; Series: M; Voltage Rating (DC): 16V; Termination: SMD/SMT; Case/Package: 0402; Number of Pins: 2; Case Code (Imperial): 0402; Length: 1mm; Halogen Free: Halogen Free; Case Code (Metric): 1005; Width: 0.02inch; RoHS Compliant: Yes; Radiation Hardening: No; Max Operating Temperature: 85°C; Height: 0.5mm; Construction: Flat
C277 C278 C282-C284 C288 C289 C293 C294 C298 C299 C301 = CMP-2008-02519-2: as C26 on sheet 02-USER_IO; Package Quantity: 1; Capacitance: 100nF; Min Operating Temperature: -55°C; Voltage: 25V; Voltage Rating: 25V; Construction: Flat; Max Operating Temperature: 125°C; Radiation Hardening: No; Depth: 0.5mm; Thickness: 0.022inch; Voltage Rating (DC): 25V; Number of Pins: 2; Lead Free: Lead Free; Series: -; REACH SVHC: No SVHC; Length: 1mm; Dielectric: X7R; RoHS Compliant: Yes; Mount: Surface Mount; Packaging: Tape and Reel; Case/Package: 0402; Case Code (Imperial): 0402; Termination: SMD/SMT; Width: 0.02inch; Case Code (Metric): 1005; Tolerance: 10%
C302 = CMP-2008-03417-2: as C331 on sheet 07-1G Phy1; Temperature Range High: +125°C; Lead Free: Yes; Capacitance: 100 pF; Value: 100 pF; ComponentLink2URL: https://content.kemet.com/datasheets/KEM_C1002_X7R_SMD.pdf; Automotive: No; Voltage Rating: 50 V; Category: Cap; Device Class L2: Capacitors; ComponentLink2Description: Datasheet; Mouser Description: Multilayer Ceramic Capacitors MLCC - SMD/SMT 50volts 100pF C0G 2%; RoHS: TRUE; Device Class L3: Ceramic Capacitors; Temperature Range Low: -55°C; Octopart: https://octopart.com/c0402c101g5gactu-kemet-16782744; Height: 0.55mm; Ipc Land Pattern Name: CAPC10050X50; Package: C0402-BB; Device Class L1: Passive Components; Temperature: -55°C to +125°C; Digikey Description: CAP CER 100PF 50V C0G/NP0 0402
R145 = CMP-2002-07365-1: as R157 on sheet 07-1G Phy1
R146 R147 = CMP-2002-06097-1: as R158 on sheet 07-1G Phy1
R148 = CMP-2002-04904-1: as R160 on sheet 07-1G Phy1
R149 = CMP-2002-05688-1: as R161 on sheet 07-1G Phy1
R150 = CMP-2002-07763-1: as R162 on sheet 07-1G Phy1
R151-R153 = CMP-1011-00702-2: as R163 on sheet 07-1G Phy1
R154 = CMP-2002-05217-1: as R22 on sheet 01-PCIe
R155 R156 R243 R244 = CMP-2002-04569-1: as R23 on sheet 01-PCIe
U24 = CMP-04874-000002-2: IC TRANSCEIVER 1/1 48FN; RoHS Compliant: Yes
U25 = CMP-0786-00062-1: as U29 on sheet 07-1G Phy1; ComponentLink2URL: http://www.analog.com/static/imported-files/data_sheets/ADP322_323.pdf; Code_JEDEC: MO-229; Mounting Technology: Surface Mount; DatasheetVersion: Rev. A; PartNumber: ADP323ACPZ-R7; ComponentLink3URL: http://www.analog.com/static/imported-files/packages/PKG_PDF/LFCSP(CP)/CP_16_27.pdf; ComponentLink4Description: URL Link1; PackageVersion: 091609-A, 09/2009; ComponentLink1Description: Manufacturer URL; ComponentLink3Description: Package Specification; Packing: Reel; PackageReference: CP-16-27; ComponentLink4URL: Product URL:http://www.analog.com/en/ADP323/productSearch.html; ComponentLink1URL: http://www.analog.com/en/index.html; PackageDescription: 16-Pin Lead Frame Chip Scale Package, Body 3 x 3 mm, Pitch 0.5 mm; ComponentLink2Description: Datasheet
U26 = CMP-09140-000008-1: as U30 on sheet 07-1G Phy1; Nominal Supply Current: 10uA; Mount: Surface Mount; Width: 1.35mm; Max Operating Temperature: 125°C; Lead Free: Contains Lead; Package Quantity: 3000; Undervoltage Threshold: 560mV; Type: Sequencer; Packaging: Tape and Reel; Min Operating Temperature: -40°C; Radiation Hardening: No; REACH SVHC: No SVHC; Overvoltage Threshold: 640mV; Number of Pins: 6; Case/Package: SC; Length: 2.2mm; Height: 1mm; Number of Monitored Inputs: 1
U27 = CMP-06317-000053-1: as U31 on sheet 07-1G Phy1; Radiation Hardening: No; Min Operating Temperature: -40°C; Mount: Surface Mount; Series: -; RoHS Compliant: Yes; Number of Pins: 4; Reach SVHC Compliant: Yes; On-state Resistance-Max: 67MR; Package Quantity: 5000; Packaging: Tape and Reel; Max Output Current: 2A; Supply Current: 2A; Lead Free: Lead Free; Current Rating: 2A; Max Operating Temperature: 125°C; Rated Current-Max: 2A; Nominal Supply Current: 2A

## Sheet 09-General I2C Devices.SchDoc
size B; SheetNumber: 9; SheetTotal: 25
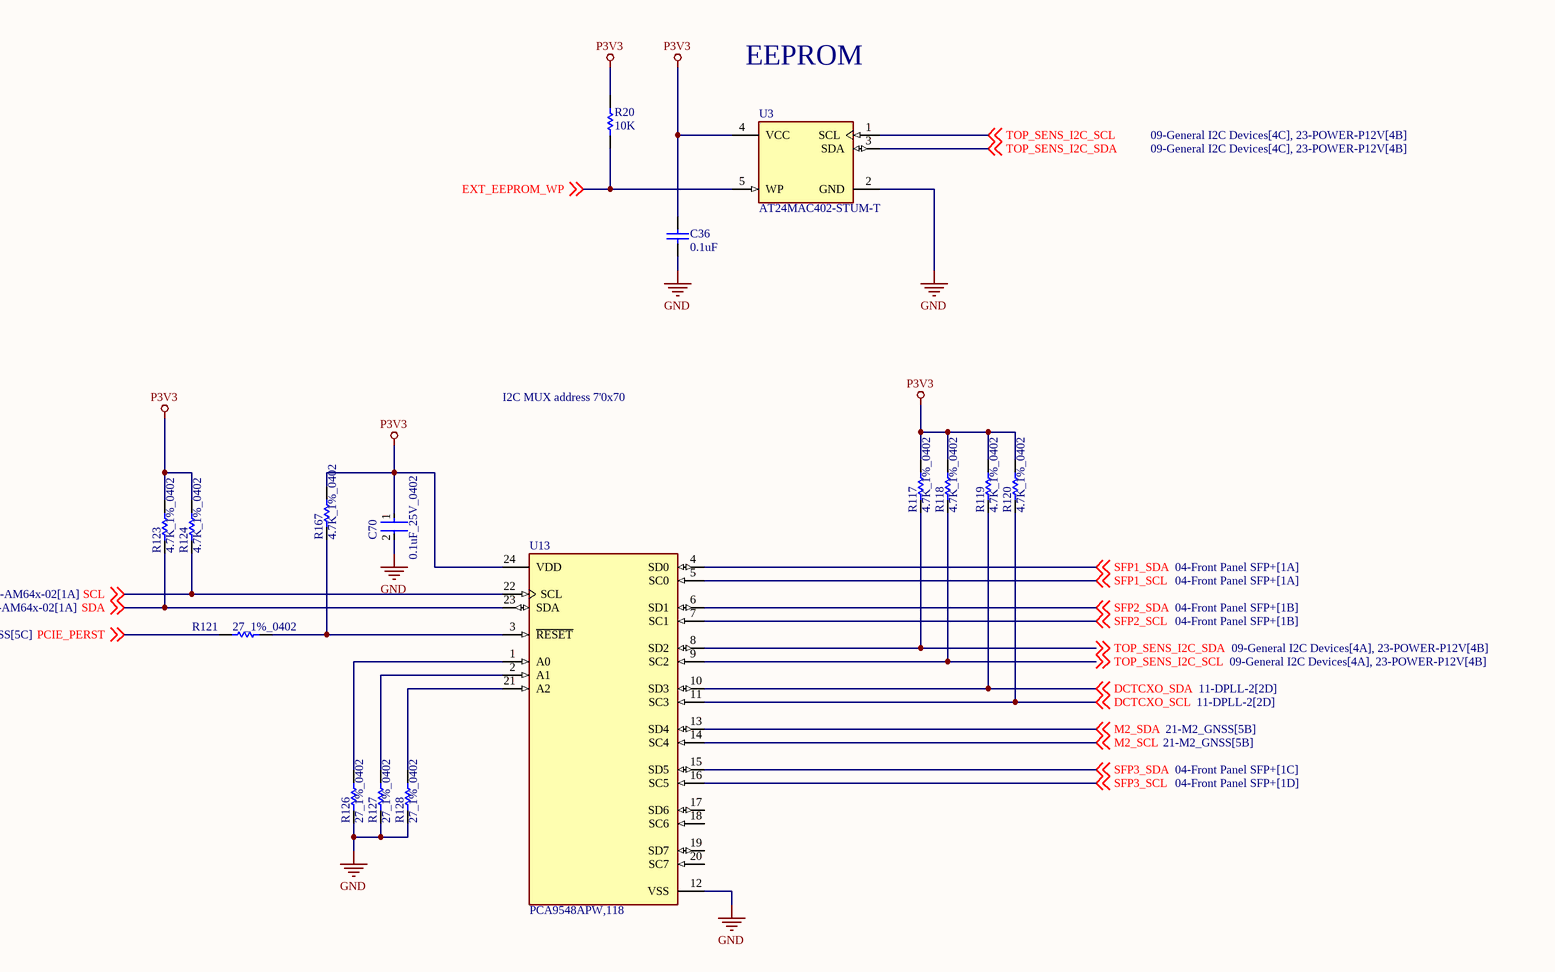
[diagram p8: 09-General I2C Devices.SchDoc]

### Parts
C36  0.1uF  [CAPC1608X87X45ML20T05]
C70  0.1uF_25V_0402  [FP-0402-L_1_0_1-W_0_5_0_1-IPC_C]
R20  10K  [RESC1608X55X30LL15T20]
R117  4.7K_1%_0402  [RESC1005X40X25NL10T10]
R118  4.7K_1%_0402  [RESC1005X40X25NL10T10]
R119  4.7K_1%_0402  [RESC1005X40X25NL10T10]
R120  4.7K_1%_0402  [RESC1005X40X25NL10T10]
R121  27_1%_0402  [RESC1005X40X25NL05T05]
R123  4.7K_1%_0402  [RESC1005X40X25NL10T10]
R124  4.7K_1%_0402  [RESC1005X40X25NL10T10]
R126  27_1%_0402  [RESC1005X40X25NL05T05]
R127  27_1%_0402  [RESC1005X40X25NL05T05]
R128  27_1%_0402  [RESC1005X40X25NL05T05]
R167  4.7K_1%_0402  [RESC1005X40X25NL10T10]
U3  AT24MAC402-STUM-T  [FP-5TS1-IPC_C]
U13  PCA9548APW,118  [FP-SOT355-1-MFG]

### Nets
GND: C36.1 C70.2 R126.1 R127.1 R128.1 U3.2(GND) U13.12(VSS)
P3V3: C36.2 C70.1 R20.2 R117.2 R118.2 R119.2 R120.2 R123.2 R124.2 R167.2 U3.4(VCC) U13.24(VDD)
DCTCXO_SCL: R120.1 U13.11(SC3) ; off-sheet DCTCXO_SCL
DCTCXO_SDA: R119.1 U13.10(SD3) ; off-sheet DCTCXO_SDA
EXT_EEPROM_WP: R20.1 U3.5(WP) ; off-sheet EXT_EEPROM_WP
M2_SCL: U13.14(SC4) ; off-sheet M2_SCL
M2_SDA: U13.13(SD4) ; off-sheet M2_SDA
PCIE_PERST: R121.1 ; off-sheet PCIE_PERST
SCL: R124.1 U13.22(SCL) ; off-sheet SCL
SDA: R123.1 U13.23(SDA) ; off-sheet SDA
SFP1_SCL: U13.5(SC0) ; off-sheet SFP1_SCL
SFP1_SDA: U13.4(SD0) ; off-sheet SFP1_SDA
SFP2_SCL: U13.7(SC1) ; off-sheet SFP2_SCL
SFP2_SDA: U13.6(SD1) ; off-sheet SFP2_SDA
SFP3_SCL: U13.16(SC5) ; off-sheet SFP3_SCL
SFP3_SDA: U13.15(SD5) ; off-sheet SFP3_SDA
TOP_SENS_I2C_SCL: R118.1 U3.1(SCL) U13.9(SC2) ; off-sheet TOP_SENS_I2C_SCL
TOP_SENS_I2C_SDA: R117.1 U3.3(SDA) U13.8(SD2) ; off-sheet TOP_SENS_I2C_SDA
NetR121_2: R121.2 R167.1 U13.3(~{RESET})
NetR126_2: R126.2 U13.1(A0)
NetR127_2: R127.2 U13.2(A1)
NetR128_2: R128.2 U13.21(A2)

Not connected (* = marked no-connect by the designer): U13 17(SD6) 18(SC6) 19(SD7) 20(SC7)

### Notes on the sheet
- EEPROM
- I2C MUX address 7'0x70

### Library data of the parts
C36 = CMP-2006-00003-1: C0603X104K5RACAUTO; Manufacturer: Kemet; Part Number: C0603X104K5RACAUTO
C70 = CMP-2008-02519-2: General Purpose Ceramic Capacitor, 0402, 100nF, 10%, X7R, 15%, 25V; Package Quantity: 1; Capacitance: 100nF; Min Operating Temperature: -55°C; Voltage: 25V; Voltage Rating: 25V; Construction: Flat; Max Operating Temperature: 125°C; Radiation Hardening: No; Depth: 0.5mm; Thickness: 0.022inch; Voltage Rating (DC): 25V; Number of Pins: 2; Lead Free: Lead Free; Series: -; REACH SVHC: No SVHC; Length: 1mm; Dielectric: X7R; RoHS Compliant: Yes; Mount: Surface Mount; Packaging: Tape and Reel; Case/Package: 0402; Case Code (Imperial): 0402; Termination: SMD/SMT; Width: 0.02inch; Case Code (Metric): 1005; Tolerance: 10%
R20 = CMP-2000-06990-1: Chip Resistor, 10 KOhm, +/- 1%, 0.1 W, -55 to 155 degC, 0603 (1608 Metric), RoHS, Tape and Reel RMCF0603FT10K0; Manufacturer: Stackpole-Electronics-Inc.; Temperature Coefficient: ±100ppm/°C; Power (Watts): 0.1W,1/10W; Package / Case: 0603(1608Metric); Datasheet Version: 01/2017; Resistance (Ohms): 10k; Features: AutomotiveAEC-Q200; Packaging: CutTape(CT); Series: RMCF; Height: 0.022"(0.55mm); Tolerance: ±1%; Manufacturer URL: https://www.seielect.com/; Datasheet URL: https://www.seielect.com/Catalog/SEI-RMCF_RMCP.pdf; Supplier Device Package: 0603; Number of Terminations: 2; Family: ChipResistor-SurfaceMount; Package Reference: 0603; Size / Dimension: 0.061"Lx0.031"W(1.55mmx0.80mm); Mounting Technology: SurfaceMount; Package Description: 2-Pin Surface Mount Device, Body 1.55 x 0.8 mm; Operating Temperature: -55°C~155°C; Composition: ThickFilm; Category: Resistors
R117-R120 R123 R124 R167 = CMP-2002-05217-1: Manufacturer: Bourns; Part Number: CR0402-FX-4701GLF
R121 R126-R128 = CMP-2002-08434-1: Part Number: CRCW040227R0FKED; Manufacturer: Vishay Dale
U3 = CMP-06313-000011-1: IC EEPROM 2K I2C 1MHZ SOT23-5; Manufacturer: Microchip; Memory Size: 2Kbits; Min Supply Voltage: 1.7V; Max Supply Voltage: 5.5V; Frequency: 1000kHz; Standoff Height: 0mm; Nominal Supply Current: 0.4-2mA; Access Time: 0.55us; Interface: I2C,2-Wire; Temperature Range Low: -40°C; Height: 1mm; ComponentLink2URL: http://ww1.microchip.com/downloads/en/DeviceDoc/Atmel-8807-SEEPROM-AT24MAC402-602-Datasheet.pdf; Ipc Land Pattern Name: SOT95P280X100-5; Category: IC; Memory Type: EEPROM; Digikey Description: IC EEPROM 2K I2C 1MHZ SOT23-5; Manufacturer Part Number: AT24MAC402-STUM-T; Device Class L1: Integrated Circuits (ICs); Temperature Range High: +85°C; ComponentLink2Description: Datasheet; RoHS: TRUE; Mouser Description: EEPROM Serial-I2C 2K-bit 256 x 8 1.8V/2.5V/3.3V/5V 5-Pin SOT-23 T/R; Octopart: https://octopart.com/at24mac402-stum-t-microchip-77758112; Temperature: -40°C to +85°C; Package: 5TS1; Device Class L3: EEPROM; Automotive: No; Device Class L2: Memory; Lead Free: Yes
U13 = CMP-2000-06880-2: IC INTERFACE SPECIALIZED 24TSSOP; Power Dissipation: 400mW; Low Level Output Current: 9mA; Number of Channels: 16; Max Frequency: 400kHz; Number of Inputs: 8; Number of Outputs: 1; On-State Resistance: 24R; Interface: I2C; Turn-On Delay Time: 300ns; Logic Function: Multiplexer; Nominal Supply Current: 100mA; Operating Supply Current: 65uA; Min Supply Voltage: 2.3V; Propagation Delay: 0.3ns; Max Supply Voltage: 5.5V; Contact Plating: Gold; Max Power Dissipation: 400mW; Mount: Surface Mount; Package Quantity: 2500; Min Operating Temperature: -40°C; Max Operating Temperature: 85°C; Case/Package: TSSOP; Number of Pins: 24; Bandwidth: 400kHz; Quiescent Current: 65uA; Packaging: Tape and Reel; Lead Free: Lead Free; Turn-Off Delay Time: 300ns; Radiation Hardening: No

## Sheet 10-DPLL-1.SchDoc
size B; SheetNumber: 10; SheetTotal: 25
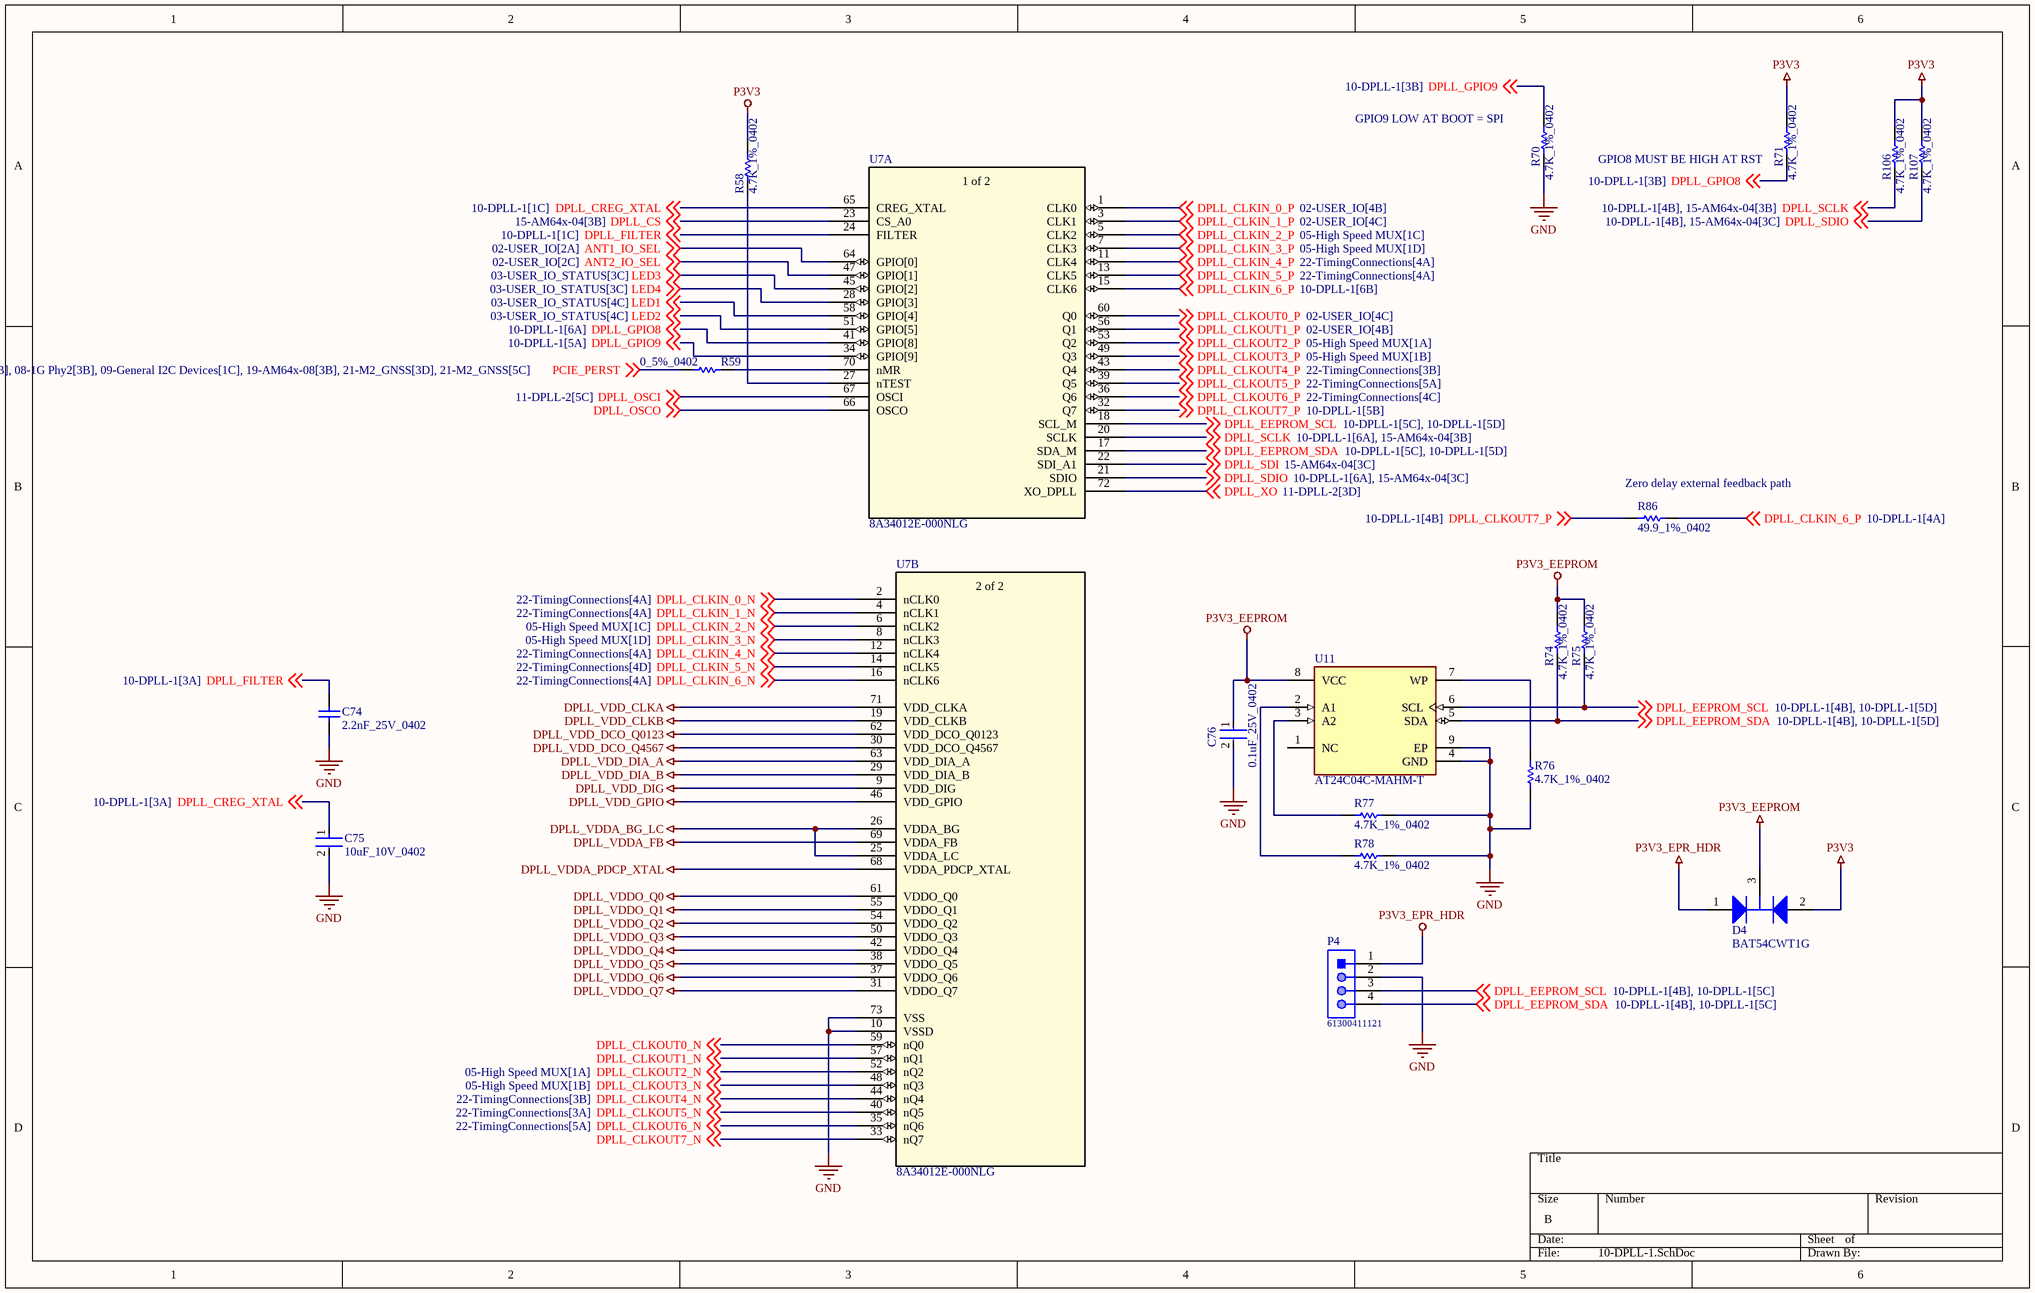
[diagram p9: 10-DPLL-1.SchDoc]

### Parts
C74  2.2nF_25V_0402  [CAPC1005X56X25LL10T15]
C75  10uF_10V_0402  [FP-CL05A106MP5NUNC-MFG]
C76  0.1uF_25V_0402  [FP-0402-L_1_0_1-W_0_5_0_1-IPC_C]
D4  BAT54CWT1G  [ONSC-SOT-323-3-419-04_V]
P4  61300411121  [61300411121]
R58  4.7K_1%_0402  [RESC1005X40X25NL10T10]
R59  0_5%_0402  [RESC1005X40X25LL10T10]
R70  4.7K_1%_0402  [RESC1005X40X25NL10T10]
R71  4.7K_1%_0402  [RESC1005X40X25NL10T10]
R74  4.7K_1%_0402  [RESC1005X40X25NL10T10]
R75  4.7K_1%_0402  [RESC1005X40X25NL10T10]
R76  4.7K_1%_0402  [RESC1005X40X25NL10T10]
R77  4.7K_1%_0402  [RESC1005X40X25NL10T10]
R78  4.7K_1%_0402  [RESC1005X40X25NL10T10]
R86  49.9_1%_0402  [RESC1005X40X25NL10T10]
R106  4.7K_1%_0402  [RESC1005X40X25NL10T10]
R107  4.7K_1%_0402  [RESC1005X40X25NL10T10]
U7  8A34012E-000NLG  [QFN_2E-000NLG_REN]  (parts A,B of 2)
U11  AT24C04C-MAHM-T  [FP-C04-21355-Q4B-IPC_B]

### Nets
DPLL_VDD_CLKA: U7.71(VDD_CLKA)
DPLL_VDD_CLKB: U7.19(VDD_CLKB)
DPLL_VDD_DCO_Q0123: U7.62(VDD_DCO_Q0123)
DPLL_VDD_DCO_Q4567: U7.30(VDD_DCO_Q4567)
DPLL_VDD_DIA_A: U7.63(VDD_DIA_A)
DPLL_VDD_DIA_B: U7.29(VDD_DIA_B)
DPLL_VDD_DIG: U7.9(VDD_DIG)
DPLL_VDD_GPIO: U7.46(VDD_GPIO)
DPLL_VDDA_BG_LC: U7.25(VDDA_LC) U7.26(VDDA_BG)
DPLL_VDDA_FB: U7.69(VDDA_FB)
DPLL_VDDA_PDCP_XTAL: U7.68(VDDA_PDCP_XTAL)
DPLL_VDDO_Q0: U7.61(VDDO_Q0)
DPLL_VDDO_Q1: U7.55(VDDO_Q1)
DPLL_VDDO_Q2: U7.54(VDDO_Q2)
DPLL_VDDO_Q3: U7.50(VDDO_Q3)
DPLL_VDDO_Q4: U7.42(VDDO_Q4)
DPLL_VDDO_Q5: U7.38(VDDO_Q5)
DPLL_VDDO_Q6: U7.37(VDDO_Q6)
DPLL_VDDO_Q7: U7.31(VDDO_Q7)
GND: C74.1 C75.2 C76.2 P4.2 R70.2 R76.2 R77.1 R78.2 U7.10(VSSD) U7.73(VSS) U11.4(GND) U11.9(EP)
P3V3: D4.2(A2) R58.2 R71.1 R106.1 R107.1
P3V3_EEPROM: C76.1 D4.3(K) R74.1 R75.1 U11.8(VCC)
P3V3_EPR_HDR: D4.1(A1) P4.1
ANT1_IO_SEL: U7.64(GPIO[0]) ; off-sheet ANT1_IO_SEL
ANT2_IO_SEL: U7.47(GPIO[1]) ; off-sheet ANT2_IO_SEL
DPLL_CLKIN_0_N: U7.2(nCLK0) ; off-sheet DPLL_CLKIN_0_N
DPLL_CLKIN_0_P: U7.1(CLK0) ; off-sheet DPLL_CLKIN_0_P
DPLL_CLKIN_1_N: U7.4(nCLK1) ; off-sheet DPLL_CLKIN_1_N
DPLL_CLKIN_1_P: U7.3(CLK1) ; off-sheet DPLL_CLKIN_1_P
DPLL_CLKIN_2_N: U7.6(nCLK2) ; off-sheet DPLL_CLKIN_2_N
DPLL_CLKIN_2_P: U7.5(CLK2) ; off-sheet DPLL_CLKIN_2_P
DPLL_CLKIN_3_N: U7.8(nCLK3) ; off-sheet DPLL_CLKIN_3_N
DPLL_CLKIN_3_P: U7.7(CLK3) ; off-sheet DPLL_CLKIN_3_P
DPLL_CLKIN_4_N: U7.12(nCLK4) ; off-sheet DPLL_CLKIN_4_N
DPLL_CLKIN_4_P: U7.11(CLK4) ; off-sheet DPLL_CLKIN_4_P
DPLL_CLKIN_5_N: U7.14(nCLK5) ; off-sheet DPLL_CLKIN_5_N
DPLL_CLKIN_5_P: U7.13(CLK5) ; off-sheet DPLL_CLKIN_5_P
DPLL_CLKIN_6_N: U7.16(nCLK6) ; off-sheet DPLL_CLKIN_6_N
DPLL_CLKIN_6_P: R86.2 U7.15(CLK6) ; off-sheet DPLL_CLKIN_6_P
DPLL_CLKOUT0_N: U7.59(nQ0) ; off-sheet DPLL_CLKOUT0_N
DPLL_CLKOUT0_P: U7.60(Q0) ; off-sheet DPLL_CLKOUT0_P
DPLL_CLKOUT1_N: U7.57(nQ1) ; off-sheet DPLL_CLKOUT1_N
DPLL_CLKOUT1_P: U7.56(Q1) ; off-sheet DPLL_CLKOUT1_P
DPLL_CLKOUT2_N: U7.52(nQ2) ; off-sheet DPLL_CLKOUT2_N
DPLL_CLKOUT2_P: U7.53(Q2) ; off-sheet DPLL_CLKOUT2_P
DPLL_CLKOUT3_N: U7.48(nQ3) ; off-sheet DPLL_CLKOUT3_N
DPLL_CLKOUT3_P: U7.49(Q3) ; off-sheet DPLL_CLKOUT3_P
DPLL_CLKOUT4_N: U7.44(nQ4) ; off-sheet DPLL_CLKOUT4_N
DPLL_CLKOUT4_P: U7.43(Q4) ; off-sheet DPLL_CLKOUT4_P
DPLL_CLKOUT5_N: U7.40(nQ5) ; off-sheet DPLL_CLKOUT5_N
DPLL_CLKOUT5_P: U7.39(Q5) ; off-sheet DPLL_CLKOUT5_P
DPLL_CLKOUT6_N: U7.35(nQ6) ; off-sheet DPLL_CLKOUT6_N
DPLL_CLKOUT6_P: U7.36(Q6) ; off-sheet DPLL_CLKOUT6_P
DPLL_CLKOUT7_N: U7.33(nQ7) ; off-sheet DPLL_CLKOUT7_N
DPLL_CLKOUT7_P: R86.1 U7.32(Q7) ; off-sheet DPLL_CLKOUT7_P
DPLL_CREG_XTAL: C75.1 U7.65(CREG_XTAL) ; off-sheet DPLL_CREG_XTAL
DPLL_CS: U7.23(CS_A0) ; off-sheet DPLL_CS
DPLL_EEPROM_SCL: P4.3 R75.2 U7.18(SCL_M) U11.6(SCL) ; off-sheet DPLL_EEPROM_SCL
DPLL_EEPROM_SDA: P4.4 R74.2 U7.17(SDA_M) U11.5(SDA) ; off-sheet DPLL_EEPROM_SDA
DPLL_FILTER: C74.2 U7.24(FILTER) ; off-sheet DPLL_FILTER
DPLL_GPIO8: R71.2 U7.41(GPIO[8]) ; off-sheet DPLL_GPIO8
DPLL_GPIO9: R70.1 U7.34(GPIO[9]) ; off-sheet DPLL_GPIO9
DPLL_OSCI: U7.67(OSCI) ; off-sheet DPLL_OSCI
DPLL_OSCO: U7.66(OSCO) ; off-sheet DPLL_OSCO
DPLL_SCLK: R106.2 U7.20(SCLK) ; off-sheet DPLL_SCLK
DPLL_SDI: U7.22(SDI_A1) ; off-sheet DPLL_SDI
DPLL_SDIO: R107.2 U7.21(SDIO) ; off-sheet DPLL_SDIO
DPLL_XO: U7.72(XO_DPLL) ; off-sheet DPLL_XO
LED1: U7.58(GPIO[4]) ; off-sheet LED1
LED2: U7.51(GPIO[5]) ; off-sheet LED2
LED3: U7.45(GPIO[2]) ; off-sheet LED3
LED4: U7.28(GPIO[3]) ; off-sheet LED4
PCIE_PERST: R59.1 ; off-sheet PCIE_PERST
NetR58_1: R58.1 U7.27(nTEST)
NetR59_2: R59.2 U7.70(nMR)
NetR76_1: R76.1 U11.7(WP)
NetR77_2: R77.2 U11.3(A2)
NetR78_1: R78.1 U11.2(A1)

Not connected (* = marked no-connect by the designer): U11 1(NC)

### Notes on the sheet
- (near R70) GPIO9 LOW AT BOOT = SPI
- GPIO8 MUST BE HIGH AT RST
- (near R86) Zero delay external feedback path
- (in symbol 8A34002E-000NLG, part A) 1 of 2
- (in symbol 8A34002E-000NLG, part B) 2 of 2

### Library data of the parts
C74 = CMP-2008-02907-1: Manufacturer: AVX Interconnect / Elco; Part Number: 04025C222JAT2A
C75 = CMP-13271-000002-1: CAP CER 10UF 10V X5R 0402; Manufacturer Part Number: CL05A106MP5NUNC; Manufacturer: Samsung; Temperature Coefficient: 15%; Tolerance: 20%; Material: Ceramic; Octopart: https://octopart.com/cl05a106mp5nunc-samsung-22457395; Voltage Rating: 10V; RoHS: TRUE; Value: 10uF; Height: 0.7mm; Digikey Description: CAP CER 10UF 10V X5R 0402; Automotive: No; Package: CL05A106MP5NUNC; Device Class L1: Passive Components; Capacitance: 10uF; Temperature Range High: +85°C; ComponentLink2Description: Datasheet; Device Class L2: Capacitors; Temperature Characteristic: X5R; Temperature: -55°C to +85°C; ComponentLink2URL: http://www.samsungsem.com/kr/support/product-search/mlcc/__icsFiles/afieldfile/2019/05/10/19-CL05A106MP5NUNC.pdf; Device Class L3: Ceramic Capacitors; Category: Cap; Temperature Range Low: -55°C; Ipc Land Pattern Name: CAPC10050X50; Lead Free: Yes
C76 = CMP-2008-02519-2: as C70 on sheet 09-General I2C Devices; Package Quantity: 1; Capacitance: 100nF; Min Operating Temperature: -55°C; Voltage: 25V; Voltage Rating: 25V; Construction: Flat; Max Operating Temperature: 125°C; Radiation Hardening: No; Depth: 0.5mm; Thickness: 0.022inch; Voltage Rating (DC): 25V; Number of Pins: 2; Lead Free: Lead Free; Series: -; REACH SVHC: No SVHC; Length: 1mm; Dielectric: X7R; RoHS Compliant: Yes; Mount: Surface Mount; Packaging: Tape and Reel; Case/Package: 0402; Case Code (Imperial): 0402; Termination: SMD/SMT; Width: 0.02inch; Case Code (Metric): 1005; Tolerance: 10%
D4 = CMP-1055-00557-1: Dual Series Cathode Schottky Barrier Diodes, 3-Pin SOT-323, Pb-Free, Tape and Reel; Manufacturer: On Semiconductor; Configuration: Common Cathode; IFSM Max (A): 0.6; trr Max (ns): 5; ComponentLink2Description: Datasheet; Packing: Tape and Reel; ComponentLink3Description: Package Specification; Mounting Technology: Surface Mount; PartNumber: BAT54CWT1G; PackageVersion: Rev. N, 11/2008; RoHS: TRUE; ComponentLink3URL: http://www.onsemi.com/pub_link/Collateral/419-04.PDF; ComponentLink2URL: http://www.onsemi.cn/pub_link/Collateral/BAT54CWT1-D.PDF; PackageReference: SOT-323-3-419-04; ComponentLink1URL: http://www.onsemi.com/; ComponentLink1Description: Manufacturer URL; DatasheetVersion: Rev. 7; PackageDescription: 3-Pin Small Outline Transistor, Body 2 x 1.25 mm, Pitch 0.65 mm
P4 = CMP-1502-01064-1: THT Vertical Pin Header WR-PHD, Pitch 2.54 mm, Single Row, 4 pins; Manufacturer: Wurth Elektronik; Withstanding Voltage: 500VAC; Rated Current: 3A; Working Voltage: 250VAC; Pin Number: 4; Gender: Male; Contact Resistance: 20mOhm; Pitch: 2.54mm; Manufacturer URL: http://www.we-online.de; Operating Temperature: -40to105degC; Packaging: Bag; Mounting Technology: THT; Package Reference: 61300411121; Datasheet URL: https://katalog.we-online.de/em/datasheet/6130xx11121.pdf; Publisher: WurthElektronik; Part Number: 61300411121; Row Number: Single; Orientation: Vertical
R58 R70 R71 R74-R78 R106 R107 = CMP-2002-05217-1: as R117-R120 on sheet 09-General I2C Devices
R59 = CMP-2002-04569-1: Manufacturer: KOA Speer; Part Number: RK73Z1ETTP
R86 = CMP-2002-04448-1: Part Number: RK73H1ETTP49R9F; Manufacturer: KOA Speer
U7 = 8A34002E-000NLG: No Description Available; Mfr_Name: Renesas Electronics; RefDes: RefDes; Type: Type
U11 = CMP-06313-000185-1: IC EEPROM 4KBIT I2C 1MHZ 8UDFN; Write Protection: YES; Max Frequency: 400kHz; Access Time: 900ns; Supply Current: 3mA; Density: 4Kb; Min Supply Voltage: 1.7V; Organization: 512X8; Max Supply Voltage: 5.5V; Number of Pins: 8; Series: -; Memory Type: EEPROM; Radiation Hardening: No; RoHS Compliant: Yes; Packaging: Tape and Reel; Interface: I2C; Min Operating Temperature: -40°C; Contact Plating: Gold; Mount: Surface Mount; Package Quantity: 5000; Nominal Supply Current: 3mA; Access Time-Max: 900ns; Max Operating Temperature: 85°C; Frequency: 400kHz